# Altium project hw.PrjPcb
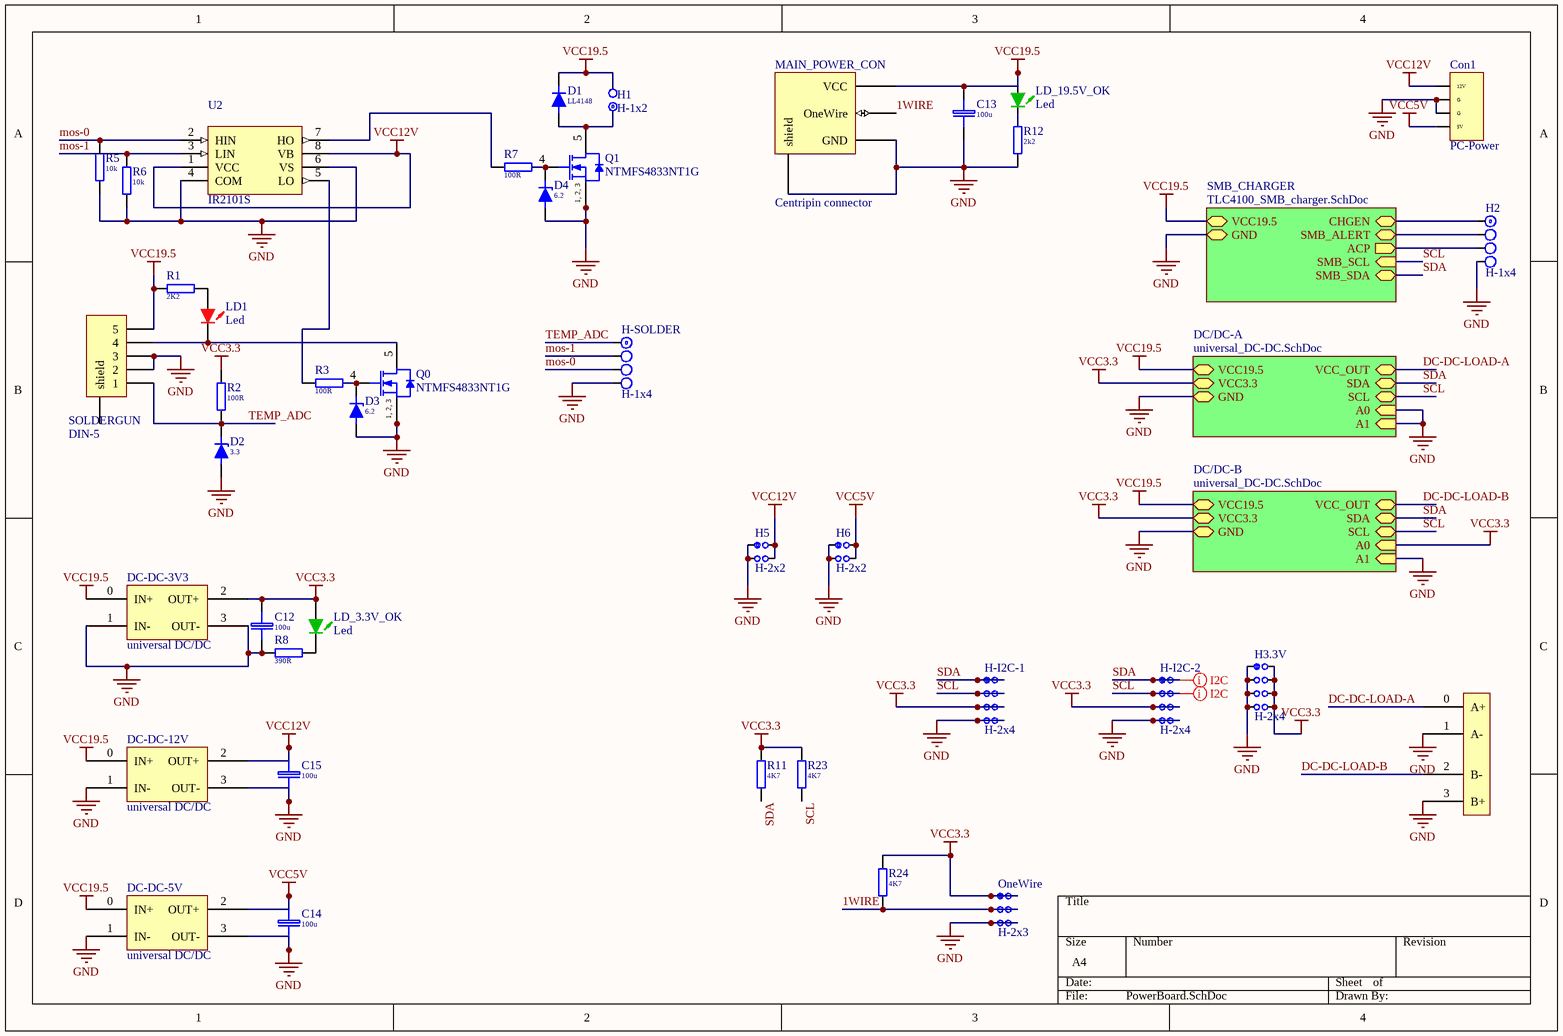
[diagram p0: PowerBoard.SchDoc]
3 sheets, 81 parts. Net scope: hierarchical (ports join the sheet entries above them; power ports are global).
Board file: PowerBoard.PcbDoc
Sheets:
  PowerBoard.SchDoc
    SMB_CHARGER = TLC4100_SMB_charger.SchDoc
    DC/DC-A = universal_DC-DC.SchDoc
    DC/DC-B = universal_DC-DC.SchDoc

## Sheet PowerBoard.SchDoc
size A4

### Parts
C12  100u  [EL SMD Case G D10x10.3 h10.2(1010)]
C13  100u  [EL SMD Case G D10x10.3 h10.2(1010)]
C14  100u  [EL SMD Case G D10x10.3 h10.2(1010)]
C15  100u  [EL SMD Case G D10x10.3 h10.2(1010)]
Con1  PC-Power  [PC-Power 4x5.08]
CON_DC_DC  Speaker terminal 4P  [Speaker termina 4x DPS]  (value not drawn)
D1  LL4148  [Micro-Melf]
D2  3.3  [SOD323]
D3  6.2  [SOD323]
D4  6.2  [SOD323]
DC-DC-3V3  universal DC/DC  [MP1584EN dc/dc 3A vertical]
DC-DC-5V  universal DC/DC  [MP1584EN dc/dc 3A vertical]
DC-DC-12V  universal DC/DC  [MP1584EN dc/dc 3A vertical]
H1  H-1x2  [J1x2]
H2  H-1x4  [J1x4]
H3.3V  H-2x4  [J2x4]
H5  H-2x2  [J2x2]
H6  H-2x2  [J2x2]
H-I2C-1  H-2x4  [J2x4]
H-I2C-2  H-2x4  [J2x4]
H-SOLDER  H-1x4  [J1x4]
LD1  Led  [Led 0805-Red]
LD_3.3V_OK  Led  [Led 0805-Green]
LD_19.5V_OK  Led  [Led 0805-Green]
MAIN_POWER_CON  Centripin connector  [Dell_centripin]
OneWire  H-2x3  [J2x3]
Q0  NTMFS4833NT1G  [ONSC-DFN-5-488AA_V]
Q1  NTMFS4833NT1G  [ONSC-DFN-5-488AA_V]
R1  2K2  [R0805]
R2  100R  [R0805]
R3  100R  [R0805]
R5  10k  [R0805]
R6  10k  [R0805]
R7  100R  [R0805]
R8  390R  [R0805]
R11  4K7  [R0805]
R12  2k2  [R0805]
R23  4K7  [R0805]
R24  4K7  [R0805]
SOLDERGUN  DIN-5  [DIN-5]
U2  IR2101S  [SO-8_L]

### Sub-sheets
DC/DC-A = universal_DC-DC.SchDoc: VCC3.3, SDA, GND, VCC19.5, VCC_OUT, A0 (in), A1 (in), SCL
DC/DC-B = universal_DC-DC.SchDoc: VCC3.3, SDA, GND, VCC19.5, VCC_OUT, A0 (in), A1 (in), SCL
SMB_CHARGER = TLC4100_SMB_charger.SchDoc: SMB_ALERT, CHGEN, ACP (out), VCC19.5, SMB_SCL (in), SMB_SDA, GND

### Nets
GND: C12.2(-) C13.2(-) C14.2(-) C15.2(-) Con1.2(G) Con1.3(G) CON_DC_DC.1(A-) CON_DC_DC.3(B+) D2.1(A) D3.1(A) D4.1(A) DC-DC-3V3.1(IN-) DC-DC-3V3.3(OUT-) DC-DC-5V.1(IN-) DC-DC-5V.3(OUT-) DC-DC-12V.1(IN-) DC-DC-12V.3(OUT-) H2.4 H3.3V.1 H3.3V.3 H3.3V.5 H3.3V.7 H5.1 H5.3 H6.1 H6.3 H-I2C-1.7 H-I2C-1.8 H-I2C-2.7 H-I2C-2.8 H-SOLDER.4 MAIN_POWER_CON.0(shield) MAIN_POWER_CON.1(GND) OneWire.5 OneWire.6 Q0.1(S) Q0.2(S) Q0.3(S) Q1.1(S) Q1.2(S) Q1.3(S) R5.1 R6.1 R8.2 R12.2 SOLDERGUN.2 SOLDERGUN.3 U2.4(COM) U2.6(VS) ; sheet SMB_CHARGER/GND, sheet DC/DC-A/GND, sheet DC/DC-A/A0, sheet DC/DC-A/A1, sheet DC/DC-B/GND, sheet DC/DC-B/A1
VCC3.3: C12.1(+) DC-DC-3V3.2(OUT+) H3.3V.2 H3.3V.4 H3.3V.6 H3.3V.8 H-I2C-1.5 H-I2C-1.6 H-I2C-2.5 H-I2C-2.6 LD_3.3V_OK.1(A) OneWire.1 OneWire.2 R2.2 R11.2 R23.2 R24.2 ; sheet DC/DC-A/VCC3.3, sheet DC/DC-B/VCC3.3, sheet DC/DC-B/A0
VCC5V: C14.1(+) Con1.1(5V) DC-DC-5V.2(OUT+) H6.2 H6.4
VCC12V: C15.1(+) Con1.4(12V) DC-DC-12V.2(OUT+) H5.2 H5.4 U2.1(VCC) U2.8(VB)
VCC19.5: C13.1(+) D1.2(C) DC-DC-3V3.0(IN+) DC-DC-5V.0(IN+) DC-DC-12V.0(IN+) H1.2 LD_19.5V_OK.1(A) MAIN_POWER_CON.3(VCC) R1.2 SOLDERGUN.5 ; sheet SMB_CHARGER/VCC19.5, sheet DC/DC-A/VCC19.5, sheet DC/DC-B/VCC19.5
1WIRE: MAIN_POWER_CON.2(OneWire) OneWire.3 OneWire.4 R24.1
DC-DC-LOAD-A: CON_DC_DC.0(A+) ; sheet DC/DC-A/VCC_OUT
DC-DC-LOAD-B: CON_DC_DC.2(B-) ; sheet DC/DC-B/VCC_OUT
mos-0: H-SOLDER.3 R5.2 U2.2(HIN)
mos-1: H-SOLDER.2 R6.2 U2.3(LIN)
SCL: H-I2C-1.3 H-I2C-1.4 H-I2C-2.3 H-I2C-2.4 R23.1 ; sheet SMB_CHARGER/SMB_SCL, sheet DC/DC-A/SCL, sheet DC/DC-B/SCL
SDA: H-I2C-1.1 H-I2C-1.2 H-I2C-2.1 H-I2C-2.2 R11.1 ; sheet SMB_CHARGER/SMB_SDA, sheet DC/DC-A/SDA, sheet DC/DC-B/SDA
TEMP_ADC: D2.2(C) H-SOLDER.1 R2.1 SOLDERGUN.1
NetD1_1: D1.1(A) H1.1 Q1.5(D)
NetD3_2: D3.2(C) Q0.4(G) R3.1
NetD4_2: D4.2(C) Q1.4(G) R7.1
NetH2_1: H2.1 ; sheet SMB_CHARGER/CHGEN
NetH2_2: H2.2 ; sheet SMB_CHARGER/SMB_ALERT
NetH2_3: H2.3 ; sheet SMB_CHARGER/ACP
NetLD1_1: LD1.1(A) R1.1
NetLD1_2: LD1.2(K) Q0.5(D) SOLDERGUN.4
NetLD_3.3V_OK_2: LD_3.3V_OK.2(K) R8.1
NetLD_19.5V_OK_2: LD_19.5V_OK.2(K) R12.1
NetR3_2: R3.2 U2.5(LO)
NetR7_2: R7.2 U2.7(HO)

Not connected (* = marked no-connect by the designer): SOLDERGUN 0(shield)

### Layout directives
net class I2C: SCL, SDA

### Notes on the sheet
- (in symbol NTMFS4833NT1G) 1, 2, 3

### Library data of the parts
C12-C15 = EL 100u/35V: EL 35V SMD Case G D10x10.3h10.5; Price: 0.014; Value: 100u
Con1 = PC-Power 4x5.08: Price: 0.07
D1 = MCL4148: SMD Micro-Melf 75V 0.3A; Price: 0.006
D2 = ZD3.3: 3.3V 0.2W; Price: 0.1; Value: 3.3
D3 D4 = ZD6.2: 6.2V 0.2W; Price: 0.1; Value: 6.2
LD1 = Led 0805 KP-2012EC: Red  627nm 12mcd; Price: 0.09
LD_3.3V_OK LD_19.5V_OK = Led 0805 KP-2012SGC: Green 565nm 15mcd; Price: 0.09
Q0 Q1 = NTMFS4833NT1G: Power MOSFET, 30 V, 191 A, Single N-Channel, 5-Pin DFN, Pb-Free, Tape and Reel; Manufacturer: On Semiconductor; Channel Polarity: N Channel; Ciss Typ (pF): 5600; Coss Typ (pF): 1200; Crss Typ (pF): 650; ID Max (A): 191; Qrr Typ (nC): 36; V(BR)DSS Min (V): 30; VGS Max (V): 20; VGS(th) Max (V): 2.5; DatasheetVersion: Rev. 9; PackageVersion: Rev. H, 03/2013; PackageReference: DFN-5-488AA; PackageDescription: 5-Pin Small Outline No-Lead, Body 4.9 x 5.9 mm, Pitch 1.27 mm; Configuration: Single; Package Type: SO-8FL / DFN-5; Packing: Tape and Reel; RoHS: Pb-Free; Mounting Technology: Surface Mount; Code_JEDEC: MO-240A; PartNumber: NTMFS4833NT1G; ComponentLink1Description: Manufacturer URL; ComponentLink1URL: http://www.onsemi.com/; ComponentLink2Description: Datasheet; ComponentLink2URL: http://www.onsemi.com/pub_link/Collateral/NTMFS4833N.PDF; ComponentLink3Description: Package Specification; ComponentLink3URL: http://www.onsemi.com/pub_link/Collateral/488AA.PDF
R1-R3 R5-R8 R11 R12 R23 R24 = R-0805: SMD 0805 0.1W 5% 150V; Price: 0.017
  R1: Value: 2K2
  R2 R3 R7: Value: 100R
  R5 R6: Value: 10k
  R8: Value: 390R
  R11 R23 R24: Value: 4K7
  R12: Value: 2k2
U2 = IR2101S: High and Low Side Driver; Published: 8-Jun-2000; LatestRevisionDate: 13-Apr-2006; LatestRevisionNote: IPC-7351 Footprint Added.; DatasheetVersion: PD60043J; PackageVersion: Feb-2001; PackageReference: SO-8; Publisher: Altium Limited; PackageDescription: 8-Pin Plastic Small Outline Integrated Circuit 1.27 mm Pitch; Code_JEDEC: MS-012-AA; Code_IPC: SOIC127P600-8; ComponentLink1Description: Manufacturer Link; ComponentLink1URL: http://www.irf.com/
H1 = H-1x2: Price: 0.02
H2 H-SOLDER = H-1x4: Price: 0.04
H3.3V H-I2C-1 H-I2C-2 = H-2x4: Price: 0.08
H5 H6 = H-2x2: Price: 0.04
OneWire = H-2x3: Price: 0.06

## Sheet TLC4100_SMB_charger.SchDoc
size A4
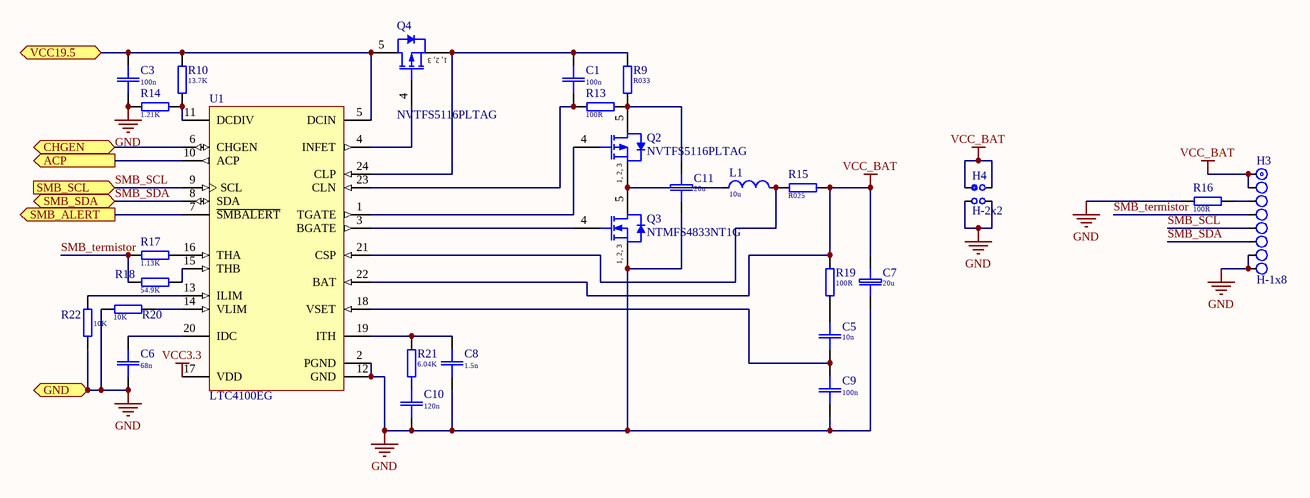
[diagram p1: TLC4100_SMB_charger.SchDoc]

### Parts
C1  100n  [C0805(2013)]
C3  100n  [C0805(2013)]
C5  10n  [C0805(2013)]
C6  68n  [C0805(2013)]
C7  20u  [EL SMD Case G D10x10.3 h10.2(1010)]
C8  1.5n  [C0805(2013)]
C9  100n  [C0805(2013)]
C10  120n  [C0805(2013)]
C11  20u  [EL SMD Case G D10x10.3 h10.2(1010)]
H3  H-1x8  [J1x8]
H4  H-2x2  [J2x2]
L1  10u  [Dr-SD-73]
Q2  NVTFS5116PLTAG  [ONSC-DFN-5-488AA_V]
Q3  NTMFS4833NT1G  [ONSC-DFN-5-488AA_V]
Q4  NVTFS5116PLTAG  [ONSC-DFN-5-488AA_V]
R9  R033  [R2512]
R10  13.7K  [R0805]
R13  100R  [R0805]
R14  1.21K  [R0805]
R15  R025  [R2512]
R16  100R  [R0805]
R17  1.13K  [R0805]
R18  54.9K  [R0805]
R19  100R  [R0805]
R20  10K  [R0805]
R21  6.04K  [R0805]
R22  10K  [R0805]
U1  LTC4100EG  [LT-G-24_N]

### Ports
ACP (out), CHGEN (bidir), GND, SMB_ALERT (out), SMB_SCL (in), SMB_SDA, VCC19.5

### Nets
GND: C3.2 C6.2 C7.2(-) C8.2 C9.2 C10.2 C11.2(-) H3.7 H3.8 H4.3 H4.4 Q3.1(S) Q3.2(S) Q3.3(S) R14.2 R16.1 R20.1 R22.1 U1.2(PGND) U1.12(GND) ; port GND
VCC3.3: U1.17(VDD)
VCC19.5: C3.1 Q4.5(D) R10.1 U1.5(DCIN) ; port VCC19.5
VCC_BAT: C7.1(+) H3.1 H3.2 H4.1 H4.2 R15.1 R19.1 U1.22(BAT)
SMB_SCL: H3.5 U1.9(SCL) ; port SMB_SCL  [project net SCL]
SMB_SDA: H3.6 U1.8(SDA) ; port SMB_SDA  [project net SDA]
SMB_termistor: H3.4 R17.2 R18.2
NetC1_1: C1.1 Q4.1(S) Q4.2(S) Q4.3(S) R9.2 U1.24(CLP)
NetC1_2: C1.2 R13.2 U1.23(CLN)
NetC5_1: C5.1 R19.2
NetC5_2: C5.2 C9.1 U1.18(VSET)
NetC6_1: C6.1 U1.20(IDC)
NetC8_1: C8.1 R21.1 U1.19(ITH)
NetC10_1: C10.1 R21.2
NetC11_1: C11.1(+) Q2.5(D) R9.1 R13.1
NetH2_1: U1.6(CHGEN) ; port CHGEN
NetH2_2: U1.7(~{SMBALERT}) ; port SMB_ALERT
NetH2_3: U1.10(ACP) ; port ACP
NetH3_3: H3.3 R16.2
NetL1_1: L1.1 Q2.1(S) Q2.2(S) Q2.3(S) Q3.5(D)
NetL1_2: L1.2 R15.2 U1.21(CSP)
NetQ2_4: Q2.4(G) U1.1(TGATE)
NetQ3_4: Q3.4(G) U1.3(BGATE)
NetQ4_4: Q4.4(G) U1.4(INFET)
NetR10_2: R10.2 R14.1 U1.11(DCDIV)
NetR17_1: R17.1 U1.16(THA)
NetR18_1: R18.1 U1.15(THB)
NetR20_2: R20.2 U1.14(VLIM)
NetR22_2: R22.2 U1.13(ILIM)

### Notes on the sheet
- (in symbol NTMFS4833NT1G) 1, 2, 3
- (in symbol NVTFS5116PLTAG) 1, 2, 3

### Library data of the parts
C1 C3 C5 C6 C8-C10 = C-0805  100V 10n: SMD-0805 100V X7R 10%; Price: 0.062
  C1 C3 C9: Value: 100n
  C5: Value: 10n
  C6: Value: 68n
  C8: Value: 1.5n
  C10: Value: 120n
C7 C11 = EL 100u/35V: EL 35V SMD Case G D10x10.3h10.5; Price: 0.014; Value: 20u
L1 = L-SD-73 10uH: 2.1A 0.08om 7x7x3.2mm; Price: 0.85; Value: 10u
Q2 Q4 = NVTFS5116PLTAG: Power MOSFET, -60 V, -14 A, 52 mOhm, Single P-Channel, 8-Pin WDFN, Pb-Free, Tape and Reel; Manufacturer: On Semiconductor; Channel Polarity: P Channel; Ciss Typ (pF): 1258; Coss Typ (pF): 127; Crss Typ (pF): 84; ID Max (A): 14; Qrr Typ (nC): 24; V(BR)DSS Min (V): 60; VGS Max (V): 20; VGS(th) Max (V): 3; DatasheetVersion: Rev. 2; PackageVersion: Rev. D, 04/2012; PackageReference: WDFN-8-511AB; PackageDescription: 8-Pin Small Outline No-Lead, Body 3.05 x 3.05 mm, Pitch 0.65 mm; Supplier 1: Digi-Key; Supplier Part Number 1: NVTFS5116PLTAG-ND; Supplier 2: Newark; Supplier Part Number 2: 65T1524; Supplier 3: Newark; Supplier Part Number 3: 95W2776; Supplier 4: Mouser; Supplier Part Number 4: 863-NVTFS5116PLTAG; Configuration: Single; Package Type: u8FL / WDFN-8; Packing: Tape and Reel; RoHS: Pb-Free; Mounting Technology: Surface Mount; PartNumber: NVTFS5116PLTAG; ComponentLink1Description: Manufacturer URL; ComponentLink1URL: http://www.onsemi.com/; ComponentLink2Description: Datasheet; ComponentLink2URL: http://www.onsemi.com/pub_link/Collateral/NVTFS5116PL-D.PDF; ComponentLink3Description: Package Specification; ComponentLink3URL: http://www.onsemi.com/pub_link/Collateral/511AB.PDF
Q3 = NTMFS4833NT1G: as Q0 on sheet PowerBoard; DatasheetVersion: Rev. 9; PackageVersion: Rev. H, 03/2013; PackageReference: DFN-5-488AA; PackageDescription: 5-Pin Small Outline No-Lead, Body 4.9 x 5.9 mm, Pitch 1.27 mm; Configuration: Single; Package Type: SO-8FL / DFN-5; Packing: Tape and Reel; RoHS: Pb-Free; Mounting Technology: Surface Mount; Code_JEDEC: MO-240A; PartNumber: NTMFS4833NT1G; ComponentLink1Description: Manufacturer URL; ComponentLink1URL: http://www.onsemi.com/; ComponentLink2Description: Datasheet; ComponentLink2URL: http://www.onsemi.com/pub_link/Collateral/NTMFS4833N.PDF; ComponentLink3Description: Package Specification; ComponentLink3URL: http://www.onsemi.com/pub_link/Collateral/488AA.PDF
R9 R10 R13-R22 = R-0805: SMD 0805 0.1W 5% 150V; Price: 0.017
  R9: Value: R033
  R10: Value: 13.7K
  R13 R16 R19: Value: 100R
  R14: Value: 1.21K
  R15: Value: R025
  R17: Value: 1.13K
  R18: Value: 54.9K
  R20 R22: Value: 10K
  R21: Value: 6.04K
U1 = LTC4100EG: Smart Battery Charger Controller, 6 to 28 V Vin, 24-pin SOP (G-24), -40 to 85 degC; Manufacturer: Linear Technology; Battery Chemistry: Li-Ion, Li-Polymer, NiCd, NiMH; Charge Termination: On-board timer, Microcontroller; Float Voltage: Adj; Max Charge Current(A): 4; Number of Cells: 2 to 6 (Li); Type of Charger: Switching, SMBus; Vin Max(V): 28; Vin Min(V): 6; DatasheetVersion: Rev. B; PackageVersion: Jun-10; PackageReference: G-24; PackageDescription: 24-Pin Plastic SSOP, Body 8.2 x 5.3 mm, Pitch 0.65 mm; Supplier 1: Digi-Key; Supplier Part Number 1: LTC4100EG-ND; Supplier 2: Newark; Supplier Part Number 2: 58M0959; RoHS: FALSE; Mounting Technology: Surface Mount; PartNumber: LTC4100EG; ComponentLink1Description: Manufacturer URL; ComponentLink1URL: http://www.linear.com/; ComponentLink2Description: Datasheet; ComponentLink2URL: http://cds.linear.com/docs/en/datasheet/4100fb.pdf; ComponentLink3Description: Package Specification; ComponentLink3URL: http://cds.linear.com/docs/en/packaging/SSOP_24_05-08-1640.pdf
H3 = H-1x8: Price: 0.08
H4 = H-2x2: Price: 0.04

## Sheet universal_DC-DC.SchDoc
size A4
Used 2 times, as channels DC/DC-A, DC/DC-B. Parts and nets are listed once, with the designators drawn on the sheet.
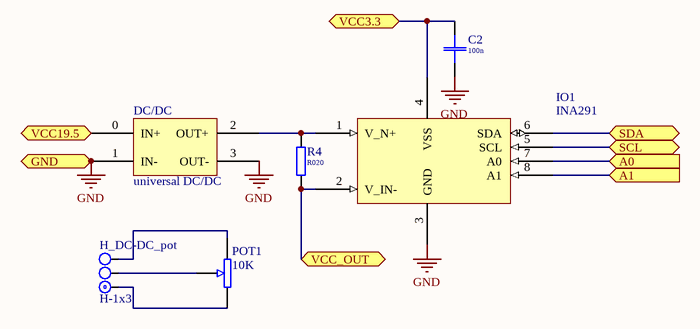
[diagram p2: universal_DC-DC.SchDoc]

### Parts
C2  100n  [C0805(2013)]
DC/DC  universal DC/DC  [MP1584EN dc/dc 3A vertical]
H_DC-DC_pot  H-1x3  [J1x3]
IO1  INA291  [SOT23-8L]
POT1  10K  [3590  potenciometer]
R4  R020  [R2512]

### Ports
A0 (in), A1 (in), GND, SCL, SDA, VCC3.3, VCC19.5, VCC_OUT

### Nets
GND: C2.2 DC/DC.1(IN-) DC/DC.3(OUT-) IO1.3(GND) ; port GND
A0: IO1.7(A0) ; port A0
A1: IO1.8(A1) ; port A1
SCL: IO1.5(SCL) ; port SCL
SDA: IO1.6(SDA) ; port SDA
VCC3.3: C2.1 IO1.4(VSS) ; port VCC3.3
VCC19.5: DC/DC.0(IN+) ; port VCC19.5
VCC_OUT: IO1.2(V_IN-) R4.2 ; port VCC_OUT
NetDC/DC_2: DC/DC.2(OUT+) IO1.1(V_N+) R4.1
NetH_DC-DC_pot_1: H_DC-DC_pot.1 POT1.3
NetH_DC-DC_pot_2: H_DC-DC_pot.2 POT1.2
NetH_DC-DC_pot_3: H_DC-DC_pot.3 POT1.1

### Channels
DC/DC-A: designators end in _DC/DC-A; ports A0=GND A1=GND GND=GND SCL=SCL SDA=SDA VCC3.3=VCC3.3 VCC19.5=VCC19.5 VCC_OUT=DC-DC-LOAD-A
DC/DC-B: designators end in _DC/DC-B; ports A0=VCC3.3 A1=GND GND=GND SCL=SCL SDA=SDA VCC3.3=VCC3.3 VCC19.5=VCC19.5 VCC_OUT=DC-DC-LOAD-B

### Library data of the parts
C2 = C-0805  100V 10n: SMD-0805 100V X7R 10%; Price: 0.062; Value: 100n
IO1 = INA291: Zerø-Drift, Bi-Directional  CURRENT/POWER MONITOR with I2C™ Interface
POT1 = Potenciometer: Value: 10K
R4 = R-0805: SMD 0805 0.1W 5% 150V; Price: 0.017; Value: R020
H_DC-DC_pot = H-1x3: Price: 0.03

## Nets that join several sheets
GND: PowerBoard (49 pins), TLC4100_SMB_charger (20 pins), DC/DC-A (6 pins), DC/DC-B (5 pins)
VCC3.3: PowerBoard (17 pins), TLC4100_SMB_charger (U1.17), DC/DC-A (C2_DC/DC-A.1 IO1_DC/DC-A.4), DC/DC-B (C2_DC/DC-B.1 IO1_DC/DC-B.4 IO1_DC/DC-B.7)
VCC19.5: PowerBoard (10 pins), TLC4100_SMB_charger (C3.1 Q4.5 R10.1 U1.5), DC/DC-A (DC/DC_DC/DC-A.0), DC/DC-B (DC/DC_DC/DC-B.0)
DC-DC-LOAD-A: PowerBoard (CON_DC_DC.0), DC/DC-A (IO1_DC/DC-A.2 R4_DC/DC-A.2)
DC-DC-LOAD-B: PowerBoard (CON_DC_DC.2), DC/DC-B (IO1_DC/DC-B.2 R4_DC/DC-B.2)
NetH2_1: PowerBoard (H2.1), TLC4100_SMB_charger (U1.6)
NetH2_2: PowerBoard (H2.2), TLC4100_SMB_charger (U1.7)
NetH2_3: PowerBoard (H2.3), TLC4100_SMB_charger (U1.10)
SCL: PowerBoard (5 pins), TLC4100_SMB_charger (H3.5 U1.9), DC/DC-A (IO1_DC/DC-A.5), DC/DC-B (IO1_DC/DC-B.5)
SDA: PowerBoard (5 pins), TLC4100_SMB_charger (H3.6 U1.8), DC/DC-A (IO1_DC/DC-A.6), DC/DC-B (IO1_DC/DC-B.6)